# EAGLE design ssslidar_v1.0_middle_plate (EAGLE 7.6.0)
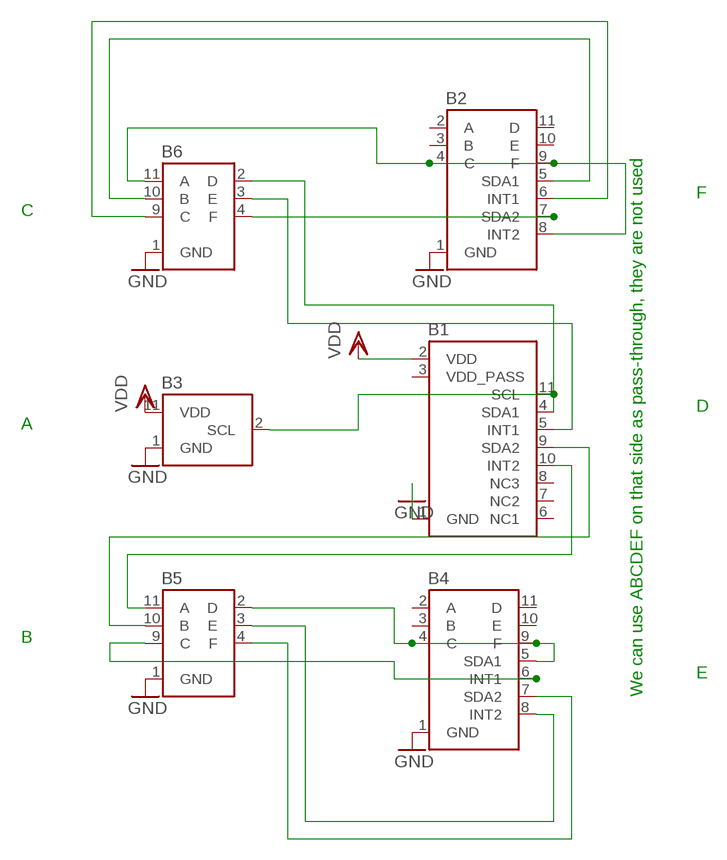
[diagram p0: schematic, sheet 1]

## Parts
B1  BLADE_PWR_BOTTOM  [BLADE]
B2  BLADE_SIG_BOTTOM  [BLADE]
B3  BLADE_PWR_TOP  [BLADE]
B4  BLADE_SIG_BOTTOM  [BLADE]
B5  BLADE_SIG_TOP  [BLADE]
B6  BLADE_SIG_TOP  [BLADE]

## Nets
GND: B1.1(GND) B2.1(GND) B3.1(GND) B4.1(GND) B5.1(GND) B6.1(GND)
N$1: B1.11(SCL) B3.2(SCL)
N$2: B2.4(C) B2.8(INT2) B2.9(F) B6.11(A)
N$3: B2.5(SDA1) B6.10(B)
N$4: B2.6(INT1) B6.9(C)
N$6: B1.5(INT1) B6.3(E)
N$7: B2.7(SDA2) B6.4(F)
N$8: B4.8(INT2) B5.3(E)
N$10: B4.4(C) B4.5(SDA1) B4.9(F) B5.2(D)
N$11: B4.6(INT1) B5.9(C)
N$12: B1.9(SDA2) B5.10(B)
N$13: B1.10(INT2) B5.11(A)
N$14: B1.4(SDA1) B6.2(D)
N$21: B4.7(SDA2) B5.4(F)
VDD: B1.2(VDD) B3.11(VDD)
Unconnected: B1.3(VDD_PASS) B1.6(NC1) B1.7(NC2) B1.8(NC3) B2.2(A) B2.3(B) B2.10(E) B2.11(D) B4.2(A) B4.3(B) B4.10(E) B4.11(D)

## Notes on the sheet
- F
- C
- D
- A
- B
- E
- We can use ABCDEF on that side as pass-through, they are not used

## Library data of the parts
B1 = ssslidar:BLADE_PWR_BOTTOM
B2 B4 = ssslidar:BLADE_SIG_BOTTOM
B3 = ssslidar:BLADE_PWR_TOP
B5 B6 = ssslidar:BLADE_SIG_TOP

## Board
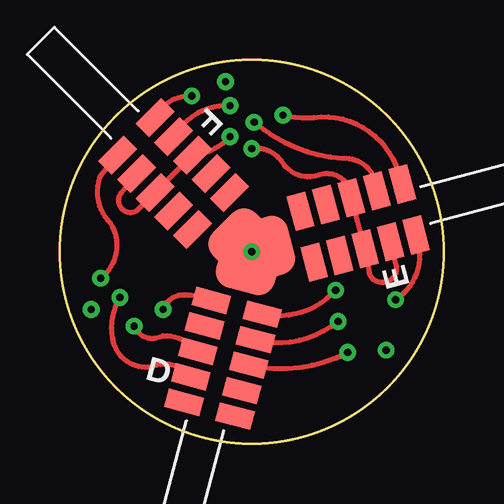
[diagram p1: board, top side]
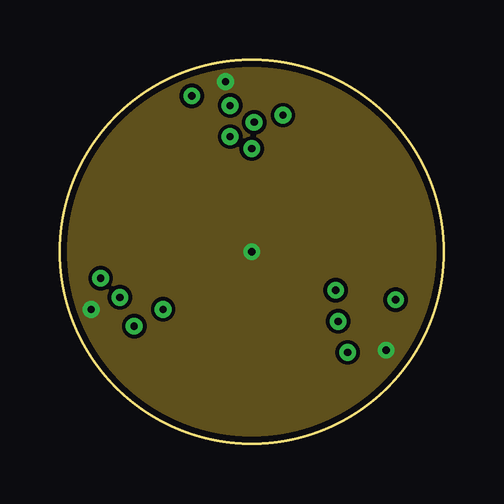
[diagram p2: board, inner layer Route2]
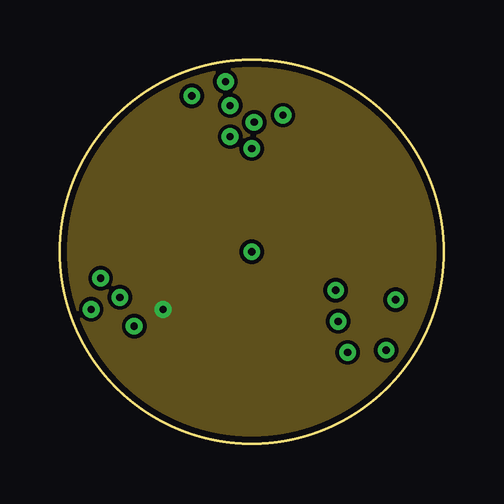
[diagram p3: board, inner layer Route3]
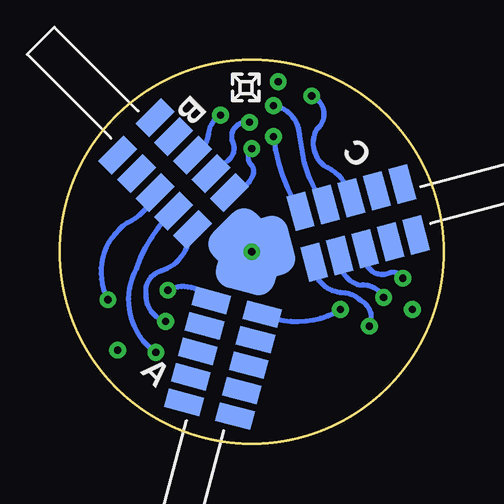
[diagram p4: board, bottom side, seen from below]

Size 16 x 16 mm. Coordinates in mm from the lower left corner, seen from the top.
Outline: circle at 8,8 radius 8
Copper layers (1*2*3*16): Top 0.035mm / dielectric 0.15mm / Route2 0.035mm / dielectric 1.1mm / Route3 0.035mm / dielectric 0.15mm / Bottom 0.035mm
Design rules "Xevelabs_6mil_4layers_eurocircuits *": minimum track width 0.15mm, minimum drill 0.25mm, track to track 0.155mm, track to pad 0.155mm, pad to pad 0.155mm, via to via 0.155mm, smd to smd 0mil, copper to edge 0.25mm, drill to drill 0.25mm, minimum pad ring 0.15mm, minimum via ring 0.2mm, stop-mask expansion 0mil, vias tented up to drill 100mil, thermal gap 0.2mm

### Footprints (pad centres in the part's own frame; a part is rotated, then mirrored left to right if it is on the bottom)
BLADE = smd 1.7 x 2.5: 1 0.85,0 | smd 0.8 x 1.5: 2 2.4,-1.1; 3 3.5,-1.1; 4 4.6,-1.1; 5 5.7,-1.1; 6 6.8,-1.1; 7 6.8,1.1; 8 5.7,1.1; 9 4.6,1.1; 10 3.5,1.1; 11 2.4,1.1

### Placement (x,y rotation side)
B1  8,8 255 top
B2  8,8 135 top
B3  8,8 255 bottom
B4  8,8 15 top
B5  8,8 135 bottom
B6  8,8 15 bottom
U$1  [XEVELABS_LOGO_S]  8.3,14.8 0 bottom

### Tracks (layer width: path | path; a pad name or v marks a point on that pad's centre or on a via)
GND  (via drill 0.3)
  Top 0.2: 8.13,8.35 B2.1 8,8.35 v8,8 | 8.13,8.35 8.35,8.35 8.35,8.13 B4.1 | 8.13,8.35 8.13,7.52 B1.1
  Bottom 0.2: B6.1 7.65,8.13 7.65,8.35 8.13,8.35 | 8.13,8.35 B3.1 | 8.13,8.35 B5.1 8,8.35 v8,8
  other vias: 6.9,15.1 13.6,3.9 1.3,5.6
  pour Route2: -3,17.2 17.9,17.2 17.9,-1 -2.3,-1
N$1  (via drill 0.3)
  Top 0.2: v11.5,6.4 arc-61 B1.11
  Bottom 0.2: B3.2 arc-78 v11.5,6.4
N$2  (via drill 0.3)
  Top 0.2: v7.1,12.8 arc-43 B2.4 B2.9 3.2,9.7 arc-166 2.6,10.5 B2.8
  Bottom 0.2: v7.1,12.8 arc-26 B6.11
N$3  (via drill 0.3)
  Top 0.2: v7.1,14.1 arc61 B2.5
  Bottom 0.2: B6.10 arc26 5.8,11.7 6,12.8 arc-80 v7.1,14.1
N$4  (via drill 0.3)
  Top 0.2: B2.6 arc-68 v5.5,14.5
  Bottom 0.2: v5.5,14.5 arc119 5.3,13.1 arc-78 5,11.6 arc51 B6.9
N$6  (via drill 0.3)
  Top 0.2: B1.5 arc74 3.8,3.2 arc-92 2.2,4.4 arc-39 v2.5,6.1
  Bottom 0.2: v2.5,6.1 arc-37 2.9,6.5 arc-32 3.5,6.6 arc81 B6.3
N$7  (via drill 0.3)
  Top 0.2: B2.7 1.7,11.2 arc69 2.1,9.2 arc-85 v1.7,6.9
  Bottom 0.2: v1.7,6.9 arc-85 2.3,7.1 arc62 3,7.2 arc66 B6.4
N$8  (via drill 0.3)
  Top 0.2: v8.1,13.4 arc36 11.8,11.9 arc-94 B4.8
  Bottom 0.2: B5.3 9,11.8 arc-82 8.8,12.6 arc121 v8.1,13.4
N$10  (via drill 0.3)
  Top 0.2: B4.5 14,7.5 arc-180 12.9,7.1 B4.4 B4.9 arc108 10.8,11.2 arc-76 9.3,11.7 arc66 v8,12.3
  Bottom 0.2: v8,12.3 arc-95 8,11.6 arc67 8,11.1 arc60 B5.2
N$11  (via drill 0.3)
  Top 0.2: v14,6 arc80 B4.6
  Bottom 0.2: B5.9 arc47 13.2,9.2 arc-84 v14,6
N$12  (via drill 0.3)
  Top 0.2: B1.9 arc40 v12,3.8
  Bottom 0.2: v12,3.8 arc47 13.1,5.6 arc37 12.8,7.3 arc28 B5.10
N$13  (via drill 0.3)
  Top 0.2: B1.10 arc54 v11.6,5.1
  Bottom 0.2: v11.6,5.1 arc76 12.4,6.2 arc84 11.8,7.2 arc-51 10.7,8.2 B5.11
N$14  (via drill 0.3)
  Top 0.2: v3.1,4.9 arc80 4,4.4 4.3,4.5 arc-52 B1.4
  Bottom 0.2: B6.2 5.2,6.8 arc-49 4.2,6.3 arc39 3.5,6 arc90 v3.1,4.9
N$21  (via drill 0.3)
  Top 0.2: v9.3,13.7 arc19 10.6,13.6 arc-76 14,11.6 B4.7
  Bottom 0.2: B5.4 arc-64 9.8,12.9 arc55 v9.3,13.7
VDD  (via drill 0.3)
  Top 0.2: v4.3,5.6 arc-77 5.3,6.2 arc-29 B1.2
  Bottom 0.2: B3.11 arc-56 v4.3,5.6
  pour Route3: -1.8,17 17.8,17.2 17.8,-1 -2.4,-1

### Text on the board
tPlace: F | E | D
bPlace: B | C | A